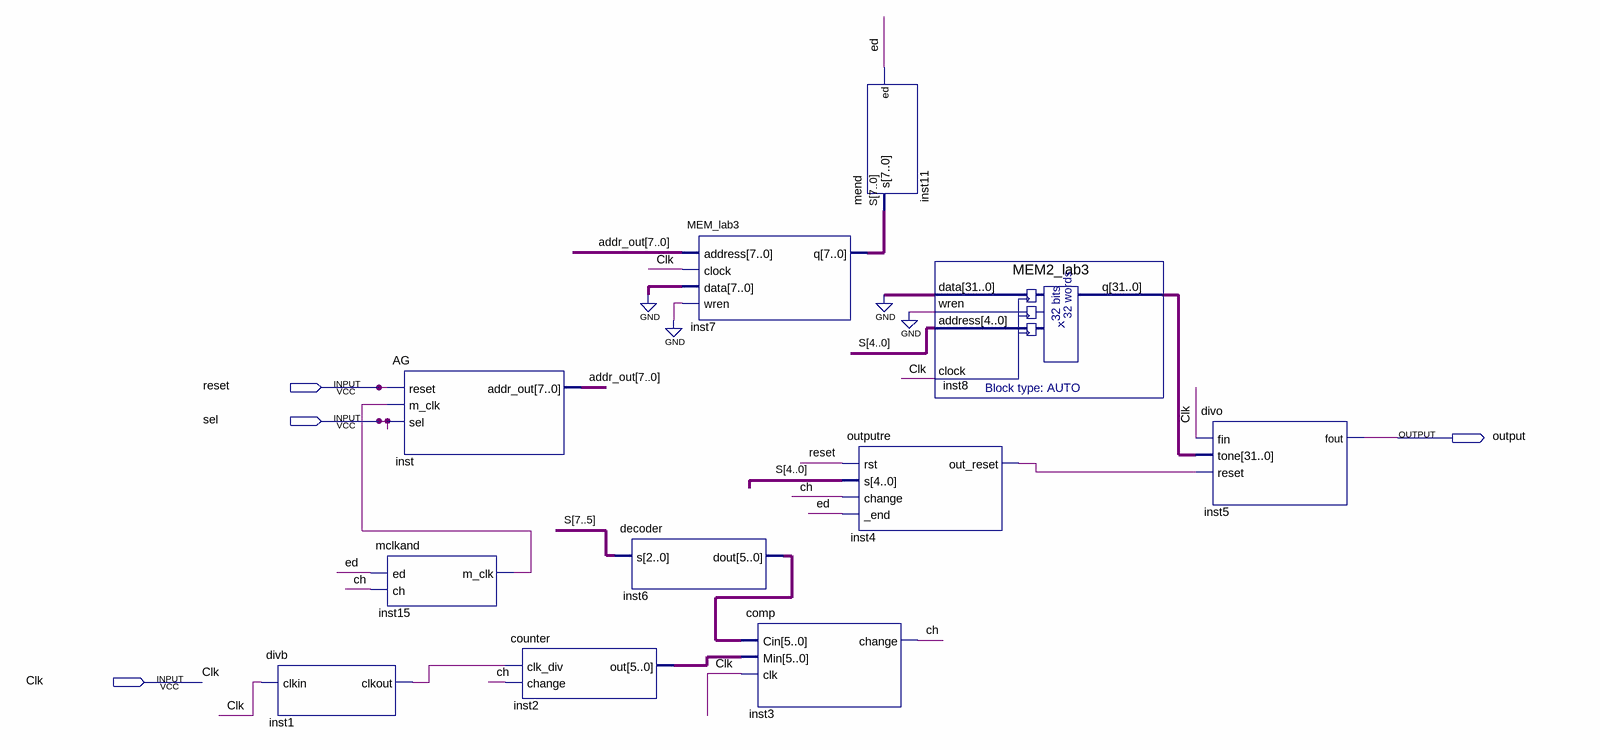
[diagram p0: schematic sheet]
// Quartus schematic lab3.bdf as structural Verilog: 11 symbols, 4 pins
module lab3 (
  input  reset,
  input  sel,
  input  Clk,
  output \output 
);

  wire ch, ed, inst1_clkout, inst4_out_reset, inst15_m_clk;
  wire [5:0] inst2_out, inst6_dout;
  wire [7:0] addr_out, S;
  wire [31:0] inst8_q;

  divb inst1 (.clkin(Clk), .clkout(inst1_clkout));
  AG inst (.reset(reset), .m_clk(inst15_m_clk), .sel(sel), .addr_out(addr_out));
  mclkand inst15 (.ed(ed), .ch(ch), .m_clk(inst15_m_clk));
  counter inst2 (.clk_div(inst1_clkout), .change(ch), .out(inst2_out));
  decoder inst6 (.s(S[7:5]), .dout(inst6_dout));
  MEM_lab3 inst7 (.address(addr_out), .clock(Clk), .data({8{1'b0}}), .wren(1'b0), .q(S));
  comp inst3 (.Cin(inst6_dout), .Min(inst2_out), .clk(Clk), .change(ch));
  mend inst11 (.s(S), .ed(ed));
  outputre inst4 (.rst(reset), .s(S[4:0]), .change(ch), ._end(ed), .out_reset(inst4_out_reset));
  MEM2_lab3 inst8 (.data({32{1'b0}}), .wren(1'b0), .address(S[4:0]), .clock(Clk), .q(inst8_q));
  divo inst5 (.fin(Clk), .tone(inst8_q), .reset(inst4_out_reset), .fout(\output ));
endmodule
